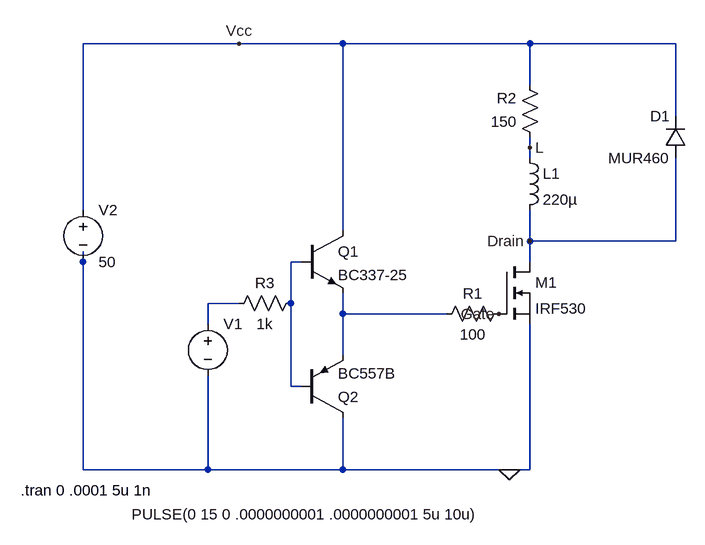
[diagram p0: schematic ej1.asc]
ej1.asc, the LTspice schematic file:
Version 4
SHEET 1 1136 680
WIRE 304 -144 64 -144
WIRE 464 -144 304 -144
WIRE 752 -144 464 -144
WIRE 976 -144 752 -144
WIRE 752 -80 752 -144
WIRE 976 -32 976 -144
WIRE 752 16 752 0
WIRE 752 32 752 16
WIRE 64 112 64 -144
WIRE 464 144 464 -144
WIRE 752 160 752 112
WIRE 976 160 976 32
WIRE 976 160 752 160
WIRE 64 192 64 176
WIRE 400 192 384 192
WIRE 752 192 752 160
WIRE 304 256 256 256
WIRE 384 256 384 192
WIRE 464 272 464 240
WIRE 624 272 464 272
WIRE 256 288 256 256
WIRE 464 336 464 272
WIRE 384 384 384 256
WIRE 400 384 384 384
WIRE 64 512 64 192
WIRE 256 512 256 368
WIRE 256 512 64 512
WIRE 464 512 464 432
WIRE 464 512 256 512
WIRE 720 512 464 512
WIRE 752 512 752 288
WIRE 752 512 720 512
FLAG 304 -144 Vcc
FLAG 752 16 L
FLAG 752 160 Drain
FLAG 704 272 Gate
FLAG 720 512 0
SYMBOL voltage 64 96 R0
WINDOW 123 0 0 Left 0
WINDOW 39 0 0 Left 0
SYMATTR InstName V2
SYMATTR Value 50
SYMBOL voltage 256 272 R0
WINDOW 3 -117 309 Left 2
WINDOW 123 0 0 Left 0
WINDOW 39 0 0 Left 0
SYMATTR Value PULSE(0 15 0 .0000000001 .0000000001 5u 10u)
SYMATTR InstName V1
SYMBOL res 720 256 R90
WINDOW 0 0 56 VBottom 2
WINDOW 3 32 56 VTop 2
SYMATTR InstName R1
SYMATTR Value 100
SYMBOL npn 400 144 R0
SYMATTR InstName Q1
SYMATTR Value BC337-25
SYMBOL pnp 400 432 M180
SYMATTR InstName Q2
SYMATTR Value BC557B
SYMBOL res 768 16 R180
WINDOW 0 36 76 Left 2
WINDOW 3 36 40 Left 2
SYMATTR InstName R2
SYMATTR Value 150
SYMBOL res 288 272 R270
WINDOW 0 32 56 VTop 2
WINDOW 3 0 56 VBottom 2
SYMATTR InstName R3
SYMATTR Value 1k
SYMBOL nmos 704 192 R0
SYMATTR InstName M1
SYMATTR Value IRF530
SYMBOL ind 736 16 R0
SYMATTR InstName L1
SYMATTR Value 220µ
SYMBOL diode 992 32 R180
WINDOW 0 24 64 Left 2
WINDOW 3 24 0 Left 2
SYMATTR InstName D1
SYMATTR Value MUR460
TEXT -32 544 Left 2 !.tran 0 .0001 5u 1n

The netlist it stands for:
* ej1.asc
V2 Vcc 0 50
V1 N002 0 PULSE(0 15 0 .0000000001 .0000000001 5u 10u)
R1 Gate N003 100
Q1 Vcc N001 N003 0 BC337-25
Q2 0 N001 N003 0 BC557B
R2 L Vcc 150
R3 N002 N001 1k
M1 Drain Gate 0 0 IRF530
L1 L Drain 220µ
D1 Drain Vcc MUR460
.model D D
.lib standard.dio
.model NPN NPN
.model PNP PNP
.lib standard.bjt
.model NMOS NMOS
.model PMOS PMOS
.lib standard.mos
.tran 0 .0001 5u 1n
.backanno
.end

* Results of the author's LTspice run, read from the files saved beside the schematic
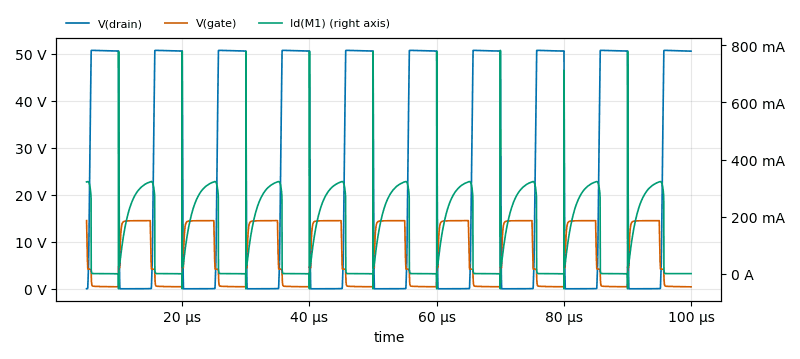
[diagram p1: Transient Analysis of ej1.asc, plotted from the saved traces]
* Transient Analysis, 1 run:
*   V(drain): min 6.586 mV, max 50.75 V, average 24.55 V, rms 34.88 V, last 50.58 V
*   V(gate): min 420.3 mV, max 14.52 V, average 7.168 V, rms 9.769 V, last 420.3 mV
*   Id(M1): min -53.32 mA, max 782.7 mA, average 134.8 mA, rms 192.9 mA, last -8.566 µA